# EAGLE schematic Helder ll - Placa redundante v1 (EAGLE 9.7.0)
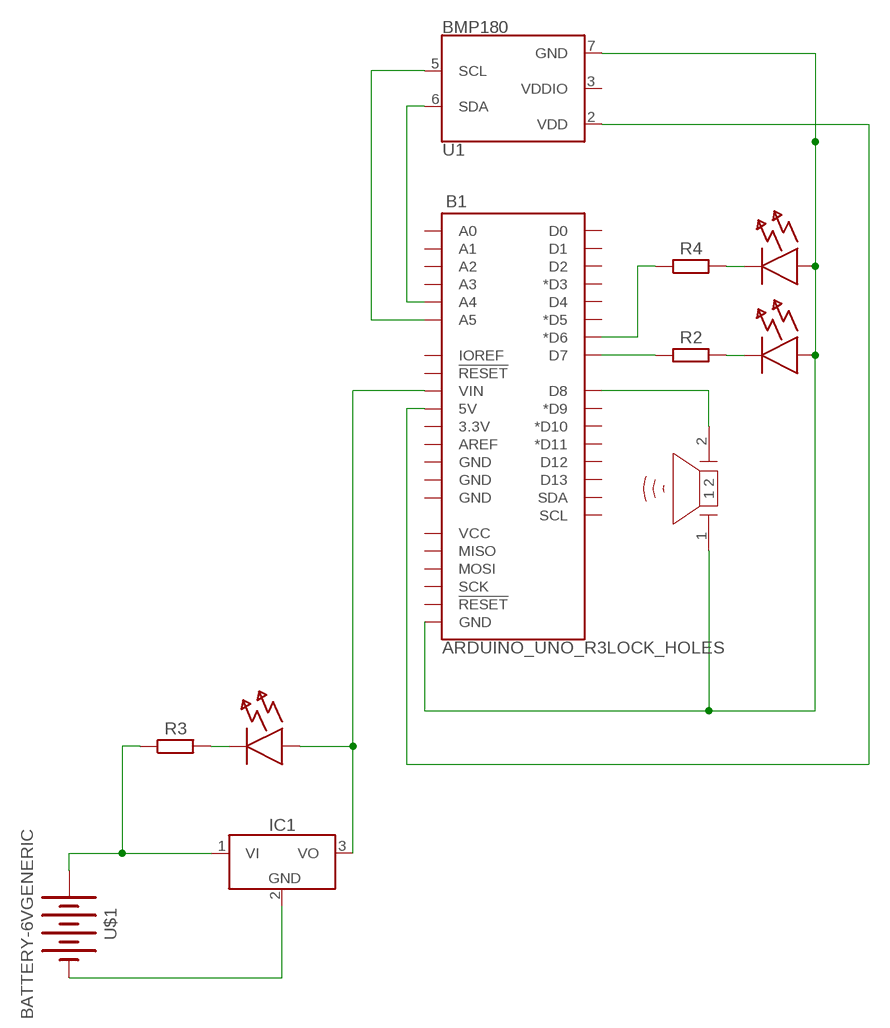
[diagram p0: schematic, sheet 1]

## Parts
B1  ARDUINO_UNO_R3LOCK_HOLES  [ARDUINO_R3_LOCK_HOLES]
D2  LED  (no package)
D3  LED  (no package)
D4  LED  (no package)
IC1  LM7805_TO220  [PMX42_TO220-NH]
LS1  PIEZO  [PIEZO]
R2  R_AXIAL-7.2MM-PITCH  [RESAD724W46L381D178B]
R3  R_AXIAL-7.2MM-PITCH  [RESAD724W46L381D178B]
R4  R_AXIAL-7.2MM-PITCH  [RESAD724W46L381D178B]
U1  BMP180  [BMP180]
U$1  BATTERY-6VGENERIC  [BATTERY-GENERIC]

## Nets
N$1: B1.D8 LS1.2
N$4: B1.D7 R2.1
N$5: IC1.1(VI) R3.1 U$1.+
N$6: B1.VIN D3.A IC1.3(VO)
N$7: D3.C R3.2
N$8: D2.C R2.2
N$9: IC1.2(GND) U$1.-
N$10: B1.D6(*D6) R4.1
N$11: D4.C R4.2
N$12: B1.GND@1(GND) D2.A D4.A LS1.1 U1.7(GND)
N$13: B1.5V U1.2(VDD)
N$14: B1.A5 U1.5(SCL)
N$15: B1.A4 U1.6(SDA)
Unconnected: B1.3.3V B1.A0 B1.A1 B1.A2 B1.A3 B1.AREF B1.D0 B1.D1 B1.D2 B1.D3(*D3) B1.D4 B1.D5(*D5) B1.D9(*D9) B1.D10(*D10) B1.D11(*D11) B1.D12 B1.D13 B1.GND@2(GND) B1.GND@3(GND) B1.GND@4(GND) B1.IOREF B1.MISO B1.MOSI B1.RESET@1(!RESET!) B1.RESET@2(!RESET!) B1.SCK B1.SCL B1.SDA B1.VCC

## Power pins joined to a net without a drawn wire
VDDIO: U1.3(VDDIO)

## Library data of the parts
B1 = SparkFun-Boards:ARDUINO_UNO_R3: Arduino R3 Footprint with SPI header Arduino Uno R3 Compatible Footprint. Matches PCB size of the original board. SparkFun Products: SAMD21 Dev Breakout <https://www.sparkfun.com/products/13672> RedBoard <https://www.sparkfun.com/products/12757> R3 Stackable Headers <https://www.sparkfun.com/products/11417>
D2-D4 = ngspice-simulation:LED: Diode
IC1 = Tinkercad:LM7805: 5V Voltage Regulator Reference Datasheet <https://www.ti.com/lit/ds/symlink/lm340.pdf>
LS1 = Tinkercad:PIEZO: Piezoelectric Sounders / Buzzers Reference Datasheet <https://www.murata.com/products/productdata/8801054621726/SPEC-PKM17EPPH4001-B0.pdf?1517839212000>
R2-R4 = Resistor:R: Resistor Fixed - Generic; CATEGORY: Resistor; SUB-CATEGORY: Fixed
U1 = SparkFun-Sensors:BMP180: Bosch BMP180 Digital Barometric Pressures Sensor The BMP180 is the function compatible successor of the BMP085, a new generation of high precision digital pressure sensors for consumer applications. The ultra-low power, low voltage electronics of the BMP180 is optimized for use in mobile phones, PDAs, GPS navigation devices and outdoor equipment. With a low altitude noise of merely 0.25m at fast conversion time, the BMP180 offers superior performance. The I2C interface allows for easy system integration with a microcontroller. The BMP180 is based on piezo-resistive technology for EMC robustness, high accuracy and linearity as well as long term stability. Web page: http://www.bosch-sensortec.com/en/homepage/products_3/environmental_sensors_1/bmp180_1/bmp180 Datasheet: http://ae-bst.resource.bosch.com/media/products/dokumente/bmp180/BST-BMP180-DS000-09.pdf SparkFun Products Barometric Pressure Sensor - BMP180 <https://www.sparkfun.com/products/11823> (COM-11823) SparkFun Barometric Pressure Sensor Breakout - BMP180 <https://www.sparkfun.com/products/11824> (SEN-11824); PROD_ID: IC-11600; SF_ID: 11823
U$1 = Tinkercad:BATTERY-6V